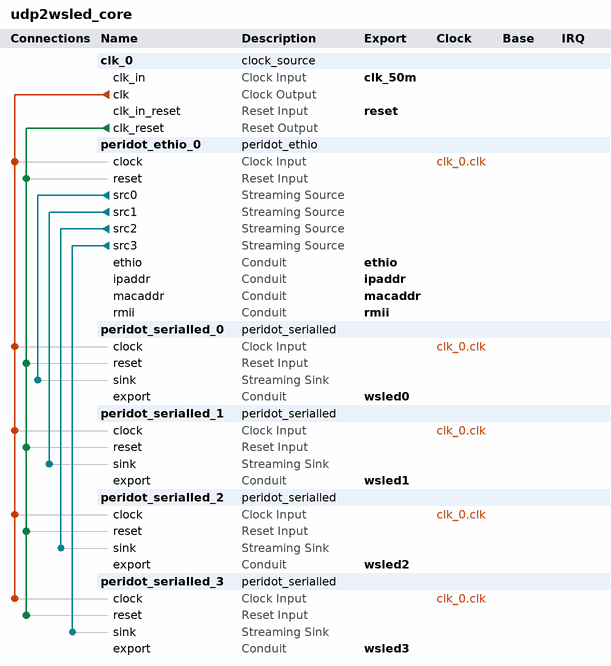
[diagram p0: system contents]
# Platform Designer (Qsys) system udp2wsled_core, MAX 10 10M02DCV36C8G
# Parameters at their usual value, and those the tool derives, are not listed.
package require -exact qsys 21.1
create_system udp2wsled_core
set_project_property DEVICE_FAMILY {MAX 10}
set_project_property DEVICE 10M02DCV36C8G

add_instance clk_0 clock_source 21.1
set_instance_parameter_value clk_0 clockFrequency 50000000

add_instance peridot_ethio_0 peridot_ethio 20.1
set_instance_parameter_value peridot_ethio_0 AVALONMM_FASTMODE 0
set_instance_parameter_value peridot_ethio_0 ENABLE_UDP_CHECKSUM 0
set_instance_parameter_value peridot_ethio_0 IGNORE_RXFCS_CHECK 0
set_instance_parameter_value peridot_ethio_0 IPADDR_VALUE 3232235890
set_instance_parameter_value peridot_ethio_0 MACADDR_VALUE 280375448305665
set_instance_parameter_value peridot_ethio_0 MTU_SIZE 1500
set_instance_parameter_value peridot_ethio_0 PART_NAME 10M02DCV36C8G
set_instance_parameter_value peridot_ethio_0 PAUSEFRAME_VALUE 65535
set_instance_parameter_value peridot_ethio_0 PAUSELESS_VALUE 0
set_instance_parameter_value peridot_ethio_0 RXFIFO_SIZE 4096
set_instance_parameter_value peridot_ethio_0 SINKFIFO_0_SIZE 2048
set_instance_parameter_value peridot_ethio_0 SINKFIFO_1_SIZE 2048
set_instance_parameter_value peridot_ethio_0 SINKFIFO_2_SIZE 2048
set_instance_parameter_value peridot_ethio_0 SINKFIFO_3_SIZE 2048
set_instance_parameter_value peridot_ethio_0 SINKFIFO_NUMBER 0
set_instance_parameter_value peridot_ethio_0 SRCFIFO_0_SIZE 1024
set_instance_parameter_value peridot_ethio_0 SRCFIFO_1_SIZE 1024
set_instance_parameter_value peridot_ethio_0 SRCFIFO_2_SIZE 1024
set_instance_parameter_value peridot_ethio_0 SRCFIFO_3_SIZE 1024
set_instance_parameter_value peridot_ethio_0 SRCFIFO_NUMBER 4
set_instance_parameter_value peridot_ethio_0 SUPPORT_HARFDUPLEX 0
set_instance_parameter_value peridot_ethio_0 SUPPORT_MEMORYHOST 0
set_instance_parameter_value peridot_ethio_0 SUPPORT_PAUSEFRAME 0
set_instance_parameter_value peridot_ethio_0 SUPPORT_SPEED_10M 0
set_instance_parameter_value peridot_ethio_0 SUPPORT_STREAMFIFO 1
set_instance_parameter_value peridot_ethio_0 TXFIFO_SIZE 4096
set_instance_parameter_value peridot_ethio_0 UDPPORT_VALUE 16241
set_instance_parameter_value peridot_ethio_0 USE_FIXED_IPADDR false
set_instance_parameter_value peridot_ethio_0 USE_FIXED_MACADDR false
set_instance_parameter_value peridot_ethio_0 USE_FIXED_PAUSE true
set_instance_parameter_value peridot_ethio_0 USE_FIXED_UDPPORT true

add_instance peridot_serialled_0 peridot_serialled 20.1
set_instance_parameter_value peridot_serialled_0 CLOCKFREQ 50000000
set_instance_parameter_value peridot_serialled_0 LED_SETTINGS_BITPERIOD 1250
set_instance_parameter_value peridot_serialled_0 LED_SETTINGS_BITSYMBOL0 350
set_instance_parameter_value peridot_serialled_0 LED_SETTINGS_BITSYMBOL1 900
set_instance_parameter_value peridot_serialled_0 LED_SETTINGS_RESETWIDTH 280
set_instance_parameter_value peridot_serialled_0 PART_NAME 10M02DCV36C8G

add_instance peridot_serialled_1 peridot_serialled 20.1
set_instance_parameter_value peridot_serialled_1 CLOCKFREQ 50000000
set_instance_parameter_value peridot_serialled_1 LED_SETTINGS_BITPERIOD 1250
set_instance_parameter_value peridot_serialled_1 LED_SETTINGS_BITSYMBOL0 350
set_instance_parameter_value peridot_serialled_1 LED_SETTINGS_BITSYMBOL1 900
set_instance_parameter_value peridot_serialled_1 LED_SETTINGS_RESETWIDTH 280
set_instance_parameter_value peridot_serialled_1 PART_NAME 10M02DCV36C8G

add_instance peridot_serialled_2 peridot_serialled 20.1
set_instance_parameter_value peridot_serialled_2 CLOCKFREQ 50000000
set_instance_parameter_value peridot_serialled_2 LED_SETTINGS_BITPERIOD 1250
set_instance_parameter_value peridot_serialled_2 LED_SETTINGS_BITSYMBOL0 350
set_instance_parameter_value peridot_serialled_2 LED_SETTINGS_BITSYMBOL1 900
set_instance_parameter_value peridot_serialled_2 LED_SETTINGS_RESETWIDTH 280
set_instance_parameter_value peridot_serialled_2 PART_NAME 10M02DCV36C8G

add_instance peridot_serialled_3 peridot_serialled 20.1
set_instance_parameter_value peridot_serialled_3 CLOCKFREQ 50000000
set_instance_parameter_value peridot_serialled_3 LED_SETTINGS_BITPERIOD 1250
set_instance_parameter_value peridot_serialled_3 LED_SETTINGS_BITSYMBOL0 350
set_instance_parameter_value peridot_serialled_3 LED_SETTINGS_BITSYMBOL1 900
set_instance_parameter_value peridot_serialled_3 LED_SETTINGS_RESETWIDTH 280
set_instance_parameter_value peridot_serialled_3 PART_NAME 10M02DCV36C8G

# connections
add_connection clk_0.clk peridot_ethio_0.clock clock
add_connection clk_0.clk peridot_serialled_0.clock clock
add_connection clk_0.clk peridot_serialled_1.clock clock
add_connection clk_0.clk peridot_serialled_2.clock clock
add_connection clk_0.clk peridot_serialled_3.clock clock
add_connection clk_0.clk_reset peridot_ethio_0.reset reset
add_connection clk_0.clk_reset peridot_serialled_0.reset reset
add_connection clk_0.clk_reset peridot_serialled_1.reset reset
add_connection clk_0.clk_reset peridot_serialled_2.reset reset
add_connection clk_0.clk_reset peridot_serialled_3.reset reset
add_connection peridot_ethio_0.src0 peridot_serialled_0.sink avalon_streaming
add_connection peridot_ethio_0.src1 peridot_serialled_1.sink avalon_streaming
add_connection peridot_ethio_0.src2 peridot_serialled_2.sink avalon_streaming
add_connection peridot_ethio_0.src3 peridot_serialled_3.sink avalon_streaming

# exported interfaces
add_interface clk_50m clock sink
set_interface_property clk_50m EXPORT_OF clk_0.clk_in
add_interface ethio conduit end
set_interface_property ethio EXPORT_OF peridot_ethio_0.ethio
add_interface ipaddr conduit end
set_interface_property ipaddr EXPORT_OF peridot_ethio_0.ipaddr
add_interface macaddr conduit end
set_interface_property macaddr EXPORT_OF peridot_ethio_0.macaddr
add_interface reset reset sink
set_interface_property reset EXPORT_OF clk_0.clk_in_reset
add_interface rmii conduit end
set_interface_property rmii EXPORT_OF peridot_ethio_0.rmii
add_interface wsled0 conduit end
set_interface_property wsled0 EXPORT_OF peridot_serialled_0.export
add_interface wsled1 conduit end
set_interface_property wsled1 EXPORT_OF peridot_serialled_1.export
add_interface wsled2 conduit end
set_interface_property wsled2 EXPORT_OF peridot_serialled_2.export
add_interface wsled3 conduit end
set_interface_property wsled3 EXPORT_OF peridot_serialled_3.export

set_interconnect_requirement {$system} qsys_mm.clockCrossingAdapter HANDSHAKE
set_interconnect_requirement {$system} qsys_mm.enableEccProtection FALSE
set_interconnect_requirement {$system} qsys_mm.insertDefaultSlave FALSE
set_interconnect_requirement {$system} qsys_mm.maxAdditionalLatency 1

save_system udp2wsled_core.qsys
